# EAGLE design DustSensorMk1 (EAGLE 9.6.2)
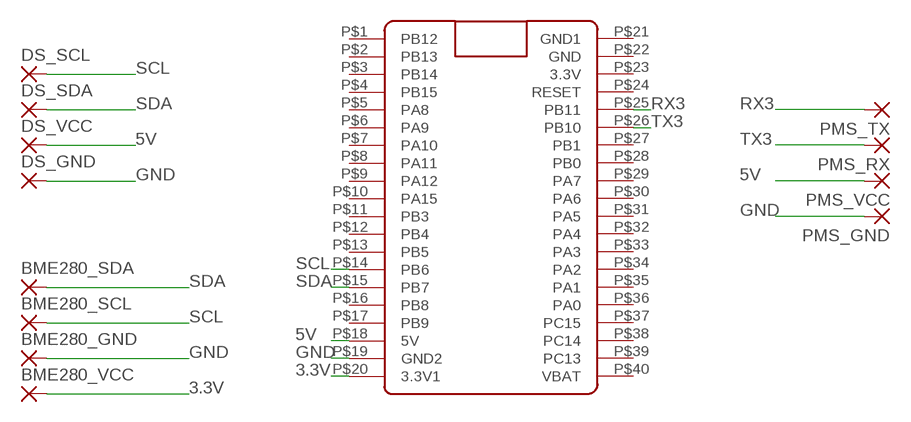
[diagram p0: schematic, sheet 1]

## Parts
BME280_GND  2,15/1,0  [2,15/1,0]
BME280_SCL  2,15/1,0  [2,15/1,0]
BME280_SDA  2,15/1,0  [2,15/1,0]
BME280_VCC  2,15/1,0  [2,15/1,0]
DS_GND  2,15/1,0  [2,15/1,0]
DS_SCL  2,15/1,0  [2,15/1,0]
DS_SDA  2,15/1,0  [2,15/1,0]
DS_VCC  2,15/1,0  [2,15/1,0]
PMS_GND  2,15/1,0  [2,15/1,0]
PMS_RX  2,15/1,0  [2,15/1,0]
PMS_TX  2,15/1,0  [2,15/1,0]
PMS_VCC  2,15/1,0  [2,15/1,0]
U$1  BLUE_PILL  [BLUE_PILL]

## Nets
3.3V: BME280_VCC.1(P) U$1.P$20(3.3V1)
5V: DS_VCC.1(P) PMS_VCC.1(P) U$1.P$18(5V)
GND: BME280_GND.1(P) DS_GND.1(P) PMS_GND.1(P) U$1.P$19(GND2)
RX3: PMS_TX.1(P) U$1.P$25(PB11)
SCL: BME280_SCL.1(P) DS_SCL.1(P) U$1.P$14(PB6)
SDA: BME280_SDA.1(P) DS_SDA.1(P) U$1.P$15(PB7)
TX3: PMS_RX.1(P) U$1.P$26(PB10)
Unconnected: U$1.P$1(PB12) U$1.P$2(PB13) U$1.P$3(PB14) U$1.P$4(PB15) U$1.P$5(PA8) U$1.P$6(PA9) U$1.P$7(PA10) U$1.P$8(PA11) U$1.P$9(PA12) U$1.P$10(PA15) U$1.P$11(PB3) U$1.P$12(PB4) U$1.P$13(PB5) U$1.P$16(PB8) U$1.P$17(PB9) U$1.P$22(GND) U$1.P$23(3.3V) U$1.P$24(RESET) U$1.P$27(PB1) U$1.P$28(PB0) U$1.P$29(PA7) U$1.P$30(PA6) U$1.P$31(PA5) U$1.P$32(PA4) U$1.P$33(PA3) U$1.P$34(PA2) U$1.P$35(PA1) U$1.P$36(PA0) U$1.P$37(PC15) U$1.P$38(PC14) U$1.P$39(PC13) U$1.P$40(VBAT)

## Power pins joined to a net without a drawn wire
GND1: U$1.P$21(GND1)

## Library data of the parts
BME280_GND BME280_SCL BME280_SDA BME280_VCC DS_GND DS_SCL DS_SDA DS_VCC PMS_GND PMS_RX PMS_TX PMS_VCC = wirepad:2,15/1,0: THROUGH-HOLE PAD
U$1 = BluePill:BLUE_PILL

## Board
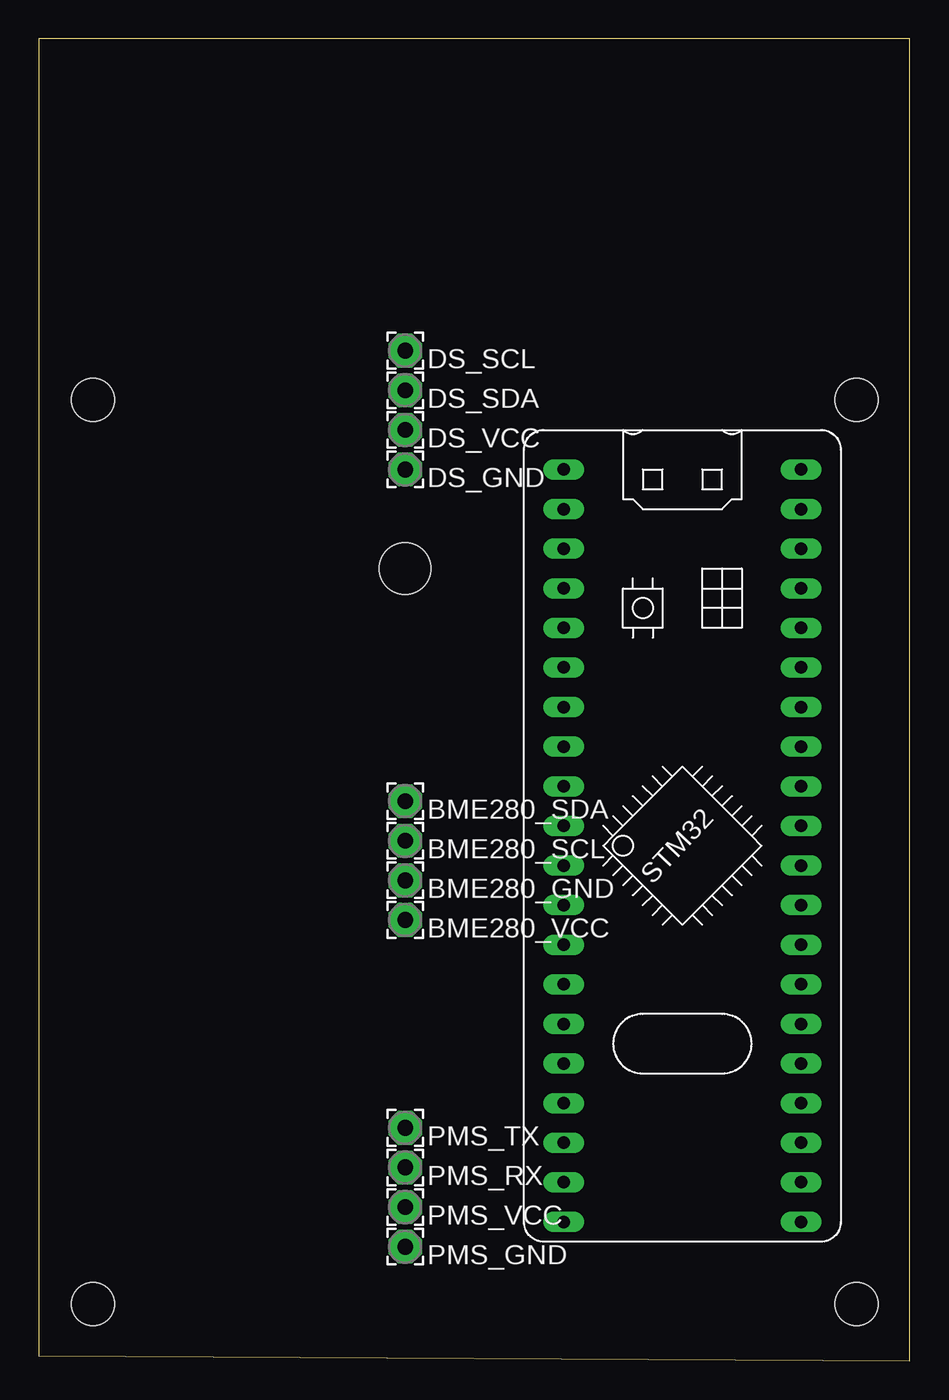
[diagram p1: board, top side]
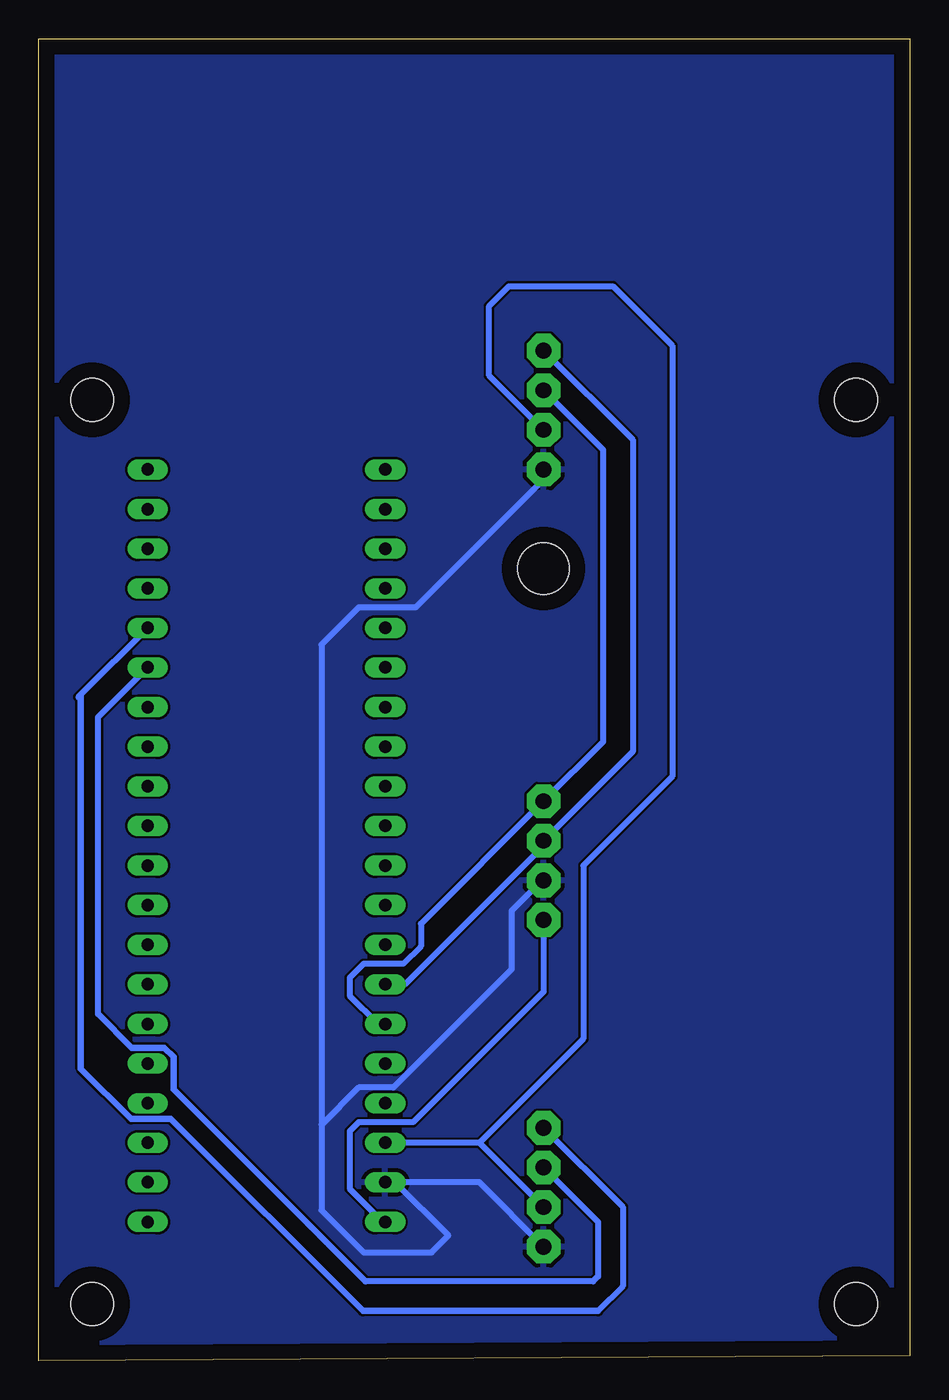
[diagram p2: board, bottom side, seen from below]

Size 55.87 x 84.76 mm. Coordinates in mm from the lower left corner, seen from the top.
Outline: 0,0.32 55.87,0 55.87,84.76 0,84.76 0,0.32
Copper layers (1*16): Top 0.035mm / dielectric 1.5mm / Bottom 0.035mm
Design rules "default": minimum track width 6mil, minimum drill 0.35mm, track to track 6mil, track to pad 6mil, pad to pad 6mil, via to via 6mil, smd to smd 6mil, copper to edge 40mil, drill to drill 6mil, minimum pad ring 10mil, minimum via ring 8mil, stop-mask expansion 4mil, vias tented up to drill 0mil, thermal gap 10mil
Holes 3.3 mm at 23.5,50.8
Holes 2.75 mm at 52.45,3.62 3.45,61.62 52.45,61.62 3.45,3.62

### Footprints (pad centres in the part's own frame; a part is rotated, then mirrored left to right if it is on the bottom)
2,15/1,0 = drill 1.016 pad 2.159 octagon: 1 0,0
BLUE_PILL = drill 0.8 long: P$1 -7.62,15.24; P$2 -7.62,12.7; P$3 -7.62,10.16; P$4 -7.62,7.62; P$5 -7.62,5.08; P$6 -7.62,2.54; P$7 -7.62,0; P$8 -7.62,-2.54; P$9 -7.62,-5.08; P$10 -7.62,-7.62; P$11 -7.62,-10.16; P$12 -7.62,-12.7; P$13 -7.62,-15.24; P$14 -7.62,-17.78; P$15 -7.62,-20.32; P$16 -7.62,-22.86; P$17 -7.62,-25.4; P$18 -7.62,-27.94; P$19 -7.62,-30.48; P$20 -7.62,-33.02; P$21 7.62,15.24; P$22 7.62,12.7; P$23 7.62,10.16; P$24 7.62,7.62; P$25 7.62,5.08; P$26 7.62,2.54; P$27 7.62,0; P$28 7.62,-2.54; P$29 7.62,-5.08; P$30 7.62,-7.62; P$31 7.62,-10.16; P$32 7.62,-12.7; P$33 7.62,-15.24; P$34 7.62,-17.78; P$35 7.62,-20.32; P$36 7.62,-22.86; P$37 7.62,-25.4; P$38 7.62,-27.94; P$39 7.62,-30.48; P$40 7.62,-33.02

### Placement (x,y rotation side)
BME280_GND  23.5,30.8 0 top
BME280_SCL  23.5,33.34 0 top
BME280_SDA  23.5,35.88 0 top
BME280_VCC  23.5,28.26 0 top
DS_GND  23.5,57.15 0 top
DS_SCL  23.5,64.77 0 top
DS_SDA  23.5,62.23 0 top
DS_VCC  23.5,59.69 0 top
PMS_GND  23.5,7.3 0 top
PMS_RX  23.5,12.38 0 top
PMS_TX  23.5,14.92 0 top
PMS_VCC  23.5,9.84 0 top
U$1  41.27,41.91 0 top

### Tracks (layer width: path | path; a pad name or v marks a point on that pad's centre or on a via)
3.3V
  Bottom 0.381: BME280_VCC.1 23.5,23.65 31.86,15.28 35.36,15.28 35.94,14.7 35.94,11.02 33.81,8.89 U$1.P$20
5V
  Bottom 0.381: PMS_VCC.1 27.62,13.97 | 27.62,13.97 U$1.P$18 | DS_VCC.1 26.99,63.18 26.99,67.63 25.72,68.9 19.05,68.9 15.24,65.09 15.24,37.47 20.95,31.75 20.95,20.64 27.62,13.97
GND
  Bottom 0.381: PMS_GND.1 27.62,11.43 U$1.P$19 33.02,11.43 29.61,8.02 30.68,6.94 35.04,6.94 37.74,9.65 37.74,15.12 | BME280_GND.1 23.6,30.8 25.55,28.85 25.55,25.09 33.13,17.51 35.36,17.51 37.74,15.12 | DS_GND.1 23.5,56.51 31.71,48.3 35.36,48.3 37.74,45.92 37.74,15.12
  pour Bottom: 0.64,84.77 55.88,84.77 55.88,0.32 0,0.32 0,84.14
RX3
  Bottom 0.381: PMS_TX.1 18.41,9.84 18.41,4.76 20,3.17 | 53.34,42.54 53.18,42.7 U$1.P$25
  Bottom 0.406: 20,3.17 35.08,3.17 47.41,15.5 49.97,15.5 53.18,18.71 53.18,42.7
SCL
  Bottom 0.381: DS_SCL.1 17.78,59.05 17.78,39.05 BME280_SCL.1 23.5,33.02 32.38,24.13 U$1.P$14
SDA
  Bottom 0.381: DS_SDA.1 19.68,58.42 19.68,39.69 BME280_SDA.1 31.37,28 31.37,26.57 32.5,25.44 35.04,25.44 35.94,24.54 35.94,23.4 34.13,21.59 U$1.P$15
TX3
  Bottom 0.381: PMS_RX.1 20,8.89 20,5.4 20.32,5.08 34.92,5.08 | U$1.P$26 52.07,41.28 52.07,22.22
  Bottom 0.406: 52.07,22.22 49.91,20.06 47.82,20.06 47.23,19.47 47.23,17.39 34.92,5.08